# Altium schematic sheet PowerModuleCell.SchDoc
size A4; SheetNumber: 2; SheetTotal: 8
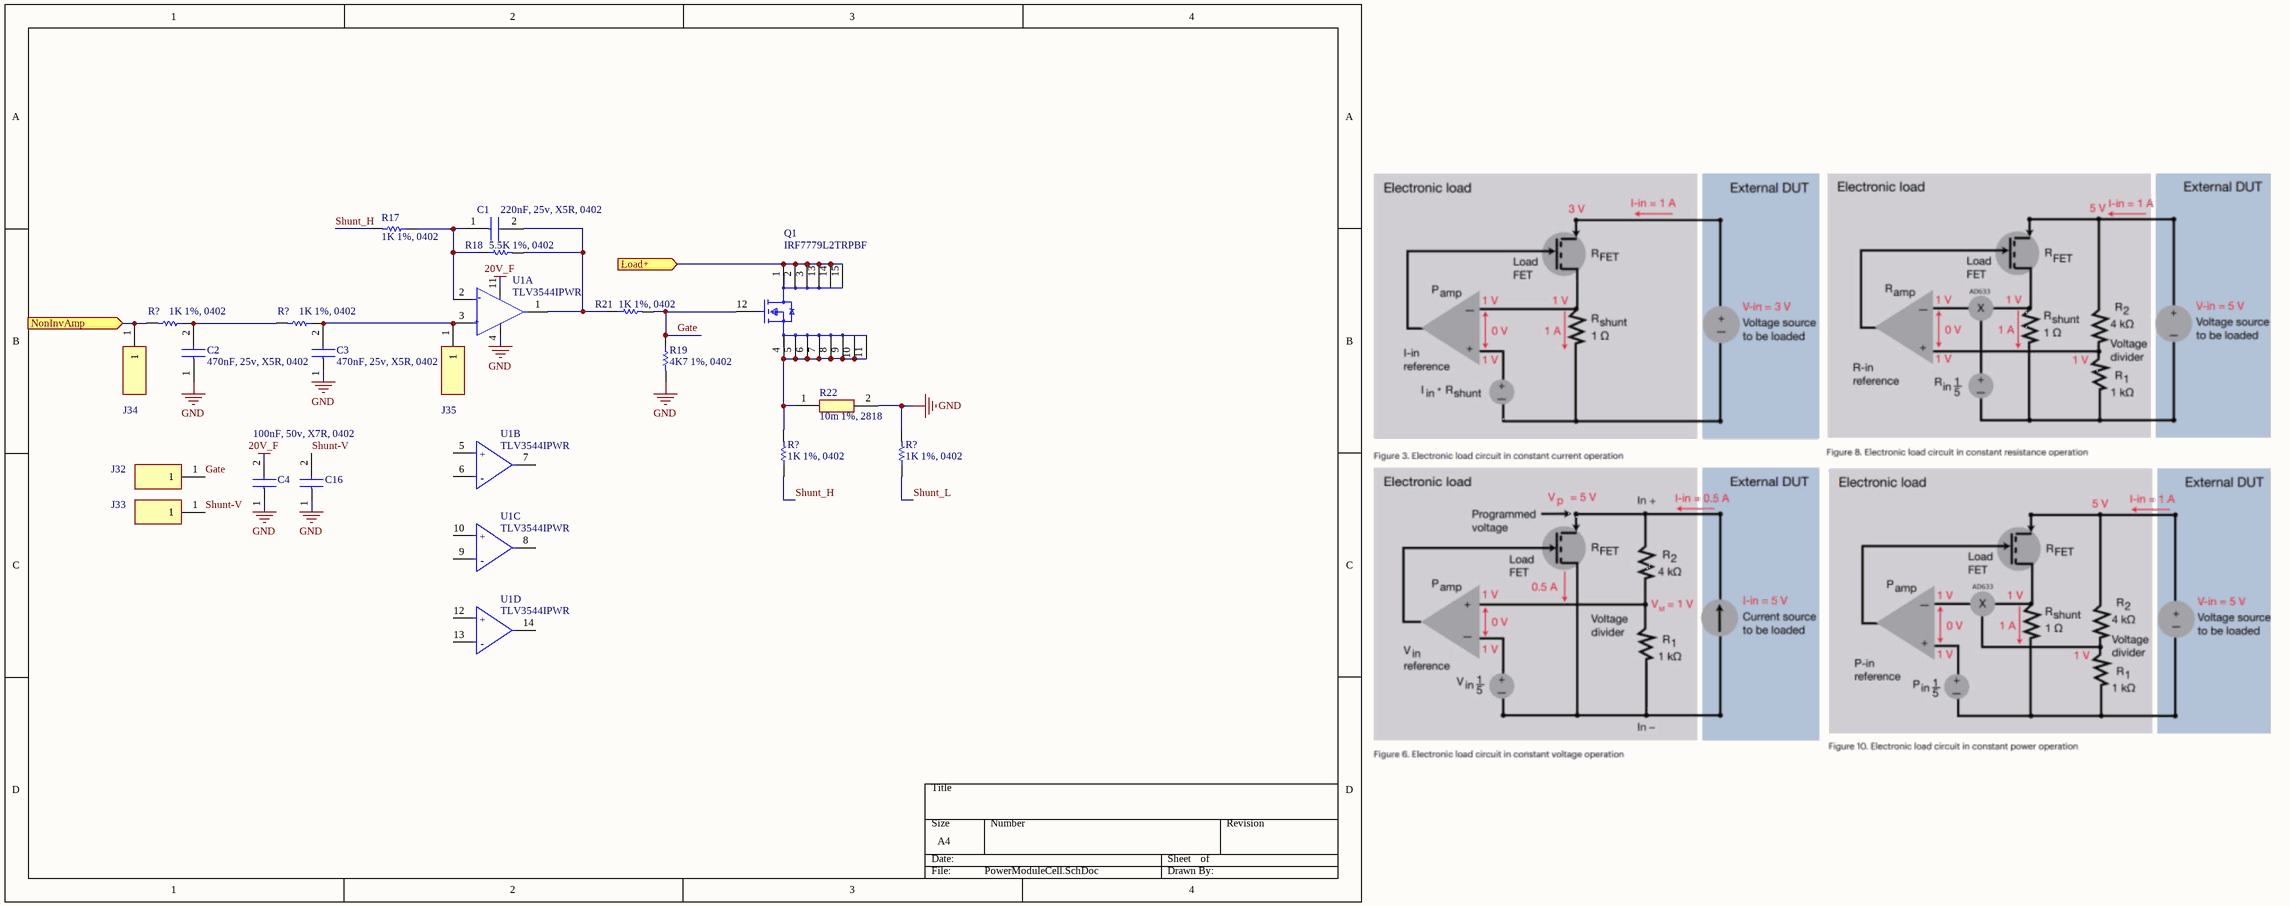
[diagram p0: PowerModuleCell.SchDoc]

## Parts
(Parts that share a designator on the sheet are numbered #1, #2 ... from top to bottom, then left to right.)
C1  220nF, 25v, X5R, 0402  [CAPC1005X55N]
C2  470nF, 25v, X5R, 0402  [CAPC1005X55N]
C3  470nF, 25v, X5R, 0402  [CAPC1005X55N]
C4  100nF, 25v, X7R, 0402  [CAPC1005X70N]  (value not drawn)
C16  100nF, 25v, X7R, 0402  [CAPC1005X70N]  (value not drawn)
J32  TestPad  [TestPad]  (value not drawn)  (no BOM)
J33  TestPad  [TestPad]  (value not drawn)  (no BOM)
J34  TestPad  [TestPad]  (value not drawn)  (no BOM)
J35  TestPad  [TestPad]  (value not drawn)  (no BOM)
Q1  IRF7779L2TRPBF  [FP-MG-WDSON-11-MFG]
R17  1K 1%, 0402  [RESC1005X40X25NL05T05]
R18  5.5K 1%, 0402  [RESC1005X40X25LL05T10]
R19  4K7 1%, 0402  [RESC1005X40X25LL05T05]
R21  1K 1%, 0402  [RESC1005X40X25NL05T05]
R22  10m 1%, 2818  [WSHP28181L000FEB]
R?#1  1K 1%, 0402  [RESC1005X40X25NL05T05]
R?#2  1K 1%, 0402  [RESC1005X40X25NL05T05]
R?#3  1K 1%, 0402  [RESC1005X40X25NL05T05]
R?#4  1K 1%, 0402  [RESC1005X40X25NL05T05]
U1  TLV3544IPWR  [FP-PW0014A-IPC_B]  (parts A,B,C,D of 4)

## Ports
Load+ (in, see PowerModule[6A]), NonInvAmp (in, see PowerModule[6A])

## Nets
20V_F: C4.2 U1.11(V-)
GND: C2.1 C3.1 C4.1 C16.1 R19.2 R22.2 R?#4.2 U1.4(V+)
Gate: J32.1 Q1.12(Gate) R19.1 R21.2
Load+: Q1.1(Drain) Q1.2(Drain) Q1.3(Drain) Q1.13(Drain) Q1.14(Drain) Q1.15(Drain) ; port Load+
NonInvAmp: J34.1 R?#1.2 ; port NonInvAmp
Shunt-V: C16.2 J33.1
Shunt_H: R17.2 R?#3.1
Shunt_L: R?#4.1
NetC1_1: C1.1 R17.1 R18.1 U1.2(-IN_A)
NetC1_2: C1.2 R18.2 R21.1 U1.1(OUT_A)
NetC2_2: C2.2 R?#1.1 R?#2.2
NetC3_2: C3.2 J35.1 R?#2.1 U1.3(+IN_A)
NetQ1_4: Q1.4(Source) Q1.5(Source) Q1.6(Source) Q1.7(Source) Q1.8(Source) Q1.9(Source) Q1.10(Source) Q1.11(Source) R22.1 R?#3.2

Not connected (* = marked no-connect by the designer): U1 5(+IN_B) 6(-IN_B) 7(OUT_B) 8(OUT_C) 9(-IN_C) 10(+IN_C) 12(+IN_D) 13(-IN_D) 14(OUT_D)

## Notes on the sheet
- 100nF, 50v, X7R, 0402
- (in symbol CMP-04895-000129-1, part A) -; +
- (in symbol CMP-04895-000129-1, part B) +; -
- (in symbol CMP-04895-000129-1, part C) +; -
- (in symbol CMP-04895-000129-1, part D) +; -

## Library data of the parts
C1 = C1005X5R1E224K050BC: Capacitor; Manufacturer_Name: TDK; Datasheet Link: https://product.tdk.com/info/en/catalog/datasheets/mlcc_commercial_midvoltage_en.pdf; Height: 0.55mm; Manufacturer_Part_Number: C1005X5R1E224K050BC; Mouser Part Number: 810-C1005X5R1E224K; Mouser Price/Stock: https://www.mouser.co.uk/ProductDetail/TDK/C1005X5R1E224K050BC?qs=dfay7wIA1uF%2FadsrSwyIjA%3D%3D; Arrow Part Number: C1005X5R1E224K050BC; Arrow Price/Stock: https://www.arrow.com/en/products/c1005x5r1e224k050bc/tdk?region=nac
C2 C3 = C1005X5R1E474K050BB: Capacitor; Manufacturer_Name: TDK; Datasheet Link: https://product.tdk.com/info/en/catalog/datasheets/mlcc_commercial_midvoltage_en.pdf; Height: 0.55mm; Manufacturer_Part_Number: C1005X5R1E474K050BB; Mouser Part Number: 810-C1005X5R1E474K; Mouser Price/Stock: https://www.mouser.co.uk/ProductDetail/TDK/C1005X5R1E474K050BB?qs=iuKcRwBk4Q8bZY0sVMzvEw%3D%3D; Arrow Part Number: C1005X5R1E474K050BB; Arrow Price/Stock: https://www.arrow.com/en/products/c1005x5r1e474k050bb/tdk?region=nac
C4 C16 = GRM155F51E104ZA01D: Capacitor; Manufacturer_Name: Murata Electronics; Datasheet Link: http://www.murata.com/~/media/webrenewal/support/library/catalog/products/capacitor/mlcc/c02e.pdf; Height: 0.7mm; Manufacturer_Part_Number: GRM155F51E104ZA01D; Mouser Part Number: 81-GRM155F51E104ZA01; Mouser Price/Stock: https://www.mouser.co.uk/ProductDetail/Murata-Electronics/GRM155F51E104ZA01D?qs=9U7yHM2lsjRRAkH%252BPNysAA%3D%3D; Arrow Part Number: GRM155F51E104ZA01D; Arrow Price/Stock: https://www.arrow.com/en/products/grm155f51e104za01d/murata-manufacturing
J32-J35 = 61300111121: Connector; Manufacturer_Name: Wurth Elektronik; Datasheet Link: https://katalog.we-online.de/em/datasheet/6130xx11121.pdf; Height: 8.89mm; Manufacturer_Part_Number: 61300111121; Mouser Part Number: 710-61300111121; Mouser Price/Stock: https://www.mouser.co.uk/ProductDetail/Wurth-Elektronik/61300111121?qs=PhR8RmCirEaRH5Ck%252B2lRLQ%3D%3D
Q1 = CMP-32901-000937-1: MOSFET N-CH 150V 375A DIRECTFET; Drain to Source Resistance: 11mR; Power Dissipation: 125W; Turn-On Delay Time: 16ns; Threshold Voltage: 4V; Input Capacitance: 6.66nF; Turn-Off Delay Time: 36ns; Gate to Source Voltage (Vgs): 20V; Length: 0.36inch; Number of Pins: 11; Min Operating Temperature: -55°C; Halogen Free: Halogen Free; Rds On Max: 11mR; REACH SVHC: No SVHC; Max Operating Temperature: 175°C; Continuous Drain Current (ID): 375A; Max Power Dissipation: 125W; Mount: Surface Mount; Width: 0.28inch; Max Dual Supply Voltage: 150V; Lead Free: Lead Free; Height: 0.02inch; Series: HEXFET®; RoHS Compliant: Yes; Drain to Source Voltage (Vdss): 150V; Packaging: Cut Tape
R17 R21 R?#1-R?#4 = CMP-1011-00510-4: Chip Resistor, 1 KOhm, +/- 1%, 100 mW, -55 to 155 degC, 0402 (1005 Metric), RoHS, Tape and Reel; PartNumber: ERJ-2RKF1001X; Manufacturer: Basic Passives; Voltage Rating: 50 V; Case\/Package: 0402; Resistance: 1 KOhm; Power Rating: 100 mW; DatasheetVersion: 04/2015; Radiation Hardening: No; Pins: 2; Height: 0.35 mm; RoHSCompliant: true; Case Code (Imperial): 0402; ComponentLink2Description: Datasheet; ComponentLink1Description: Manufacturer URL; PackageReference: 0402; Mount: Surface Mount; Package Quantity: 10000; Tolerance: 1%; ComponentLink1URL: http://www.panasonic.com/; PackageDescription: 2-Pin Surface Mount Device, Body 1 x 0.5 mm; Mounting Technology: Surface Mount; Case Code (Metric): 1005; ComponentLink2URL: http://industrial.panasonic.com/cdbs/www-data/pdf/RDA0000/AOA0000C86.pdf; REACH SVHC: Yes; Packaging: Tape and Reel; Max Operating Temperature: 155 degC; Min Operating Temperature: -55 degC; Width: 0.5 mm; Length: 1 mm
R18 = CMP-2002-07756-1: Part Number: RC0402FR-075K6L; Manufacturer: Yageo / Phycomp
R19 = CMP-2002-01154-4: Chip Resistor, 4.7 KOhm, +/- 1%, 0.1 W, -55 to 155 degC, 0402 (1005 Metric), RoHS, Tape and Reel; PartNumber: ERJ-2RKF4701X; Voltage Rating: 50 V; Case\/Package: 0402; Power Rating: 100 mW; Height: 0.35 mm; Mounting Technology: Surface Mount; REACH SVHC: Yes; Resistance: 4.7 KOhm; Max Operating Temperature: 155 degC; ComponentLink1Description: Manufacturer URL; ComponentLink2Description: Datasheet; Pins: 2; PackageReference: 0402; Tolerance: 1%; Case Code (Imperial): 0402; Length: 1 mm; PackageDescription: 2-Pin Surface Mount Device, Body 1 x 0.5 mm; RoHSCompliant: true; Package Quantity: 1; Radiation Hardening: No; DatasheetVersion: 04/2015; Width: 0.5 mm; Case Code (Metric): 1005; Mount: Surface Mount; ComponentLink1URL: http://www.panasonic.com/; Min Operating Temperature: -55 degC; Packaging: Cut Tape; ComponentLink2URL: http://industrial.panasonic.com/cdbs/www-data/pdf/RDA0000/AOA0000C86.pdf
R22 = WSHP2818R0100FEA: Resistor; Manufacturer_Name: Vishay; Datasheet Link: http://www.vishay.com/docs/30347/wshp2818.pdf; Height: 1mm; Manufacturer_Part_Number: WSHP2818R0100FEA; Mouser Part Number: 71-WSHP2818R0100FEA; Mouser Price/Stock: https://www.mouser.co.uk/ProductDetail/Vishay-Dale/WSHP2818R0100FEA?qs=WY0B%252Bpw29jNppYK03UGNJA%3D%3D; Arrow Part Number: WSHP2818R0100FEA; Arrow Price/Stock: https://www.arrow.com/en/products/wshp2818r0100fea/vishay?region=nac
U1 = CMP-04895-000129-1: IC CMOS 4 CIRCUIT 14TSSOP; Output Current per Channel: 100mA; Input Offset Voltage (Vos): 2mV; -3db Bandwidth: 200MHz; Number of Circuits: 4; Operating Supply Current: 5.2mA; Input Bias Current: 3pA; Gain Bandwidth Product: 100MHz; Slew Rate: 150V/µs; Number of Channels: 4; Max Operating Temperature: 125°C; Min Operating Temperature: -40°C; RoHS Compliant: Yes; Number of Pins: 14; Case/Package: TSSOP; Mount: Surface Mount; Packaging: Cut Tape